# EasyEDA Pro project ESP32C3_Motor_MainControl.eprj, board ESP32C3_CAN_Host
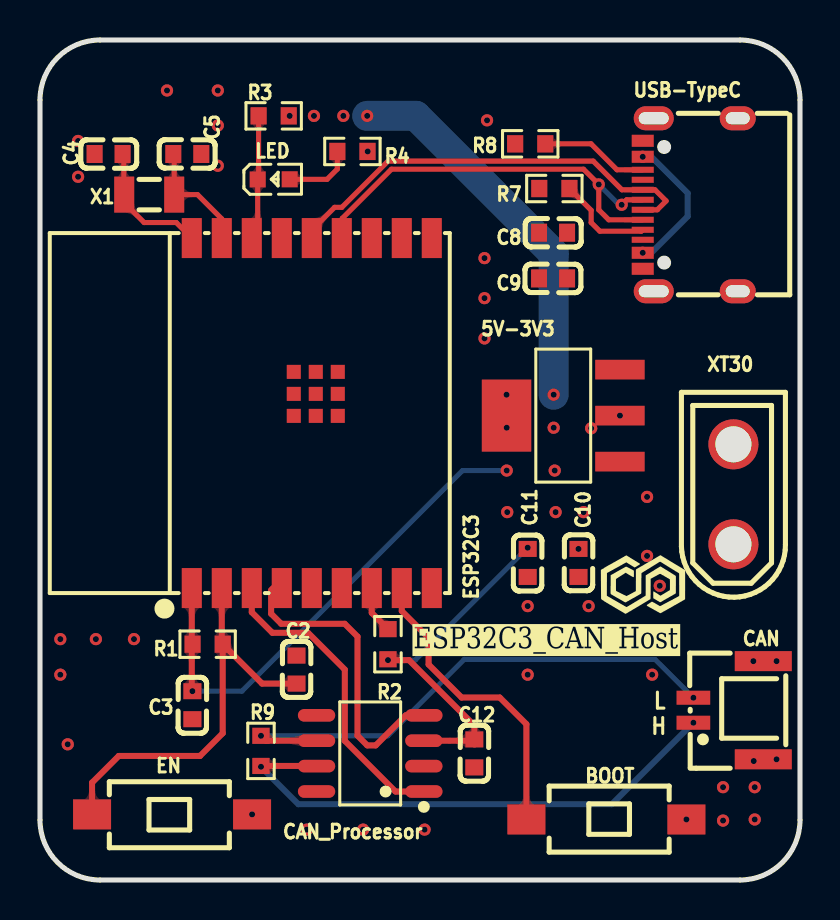
[diagram p3: board, top side]
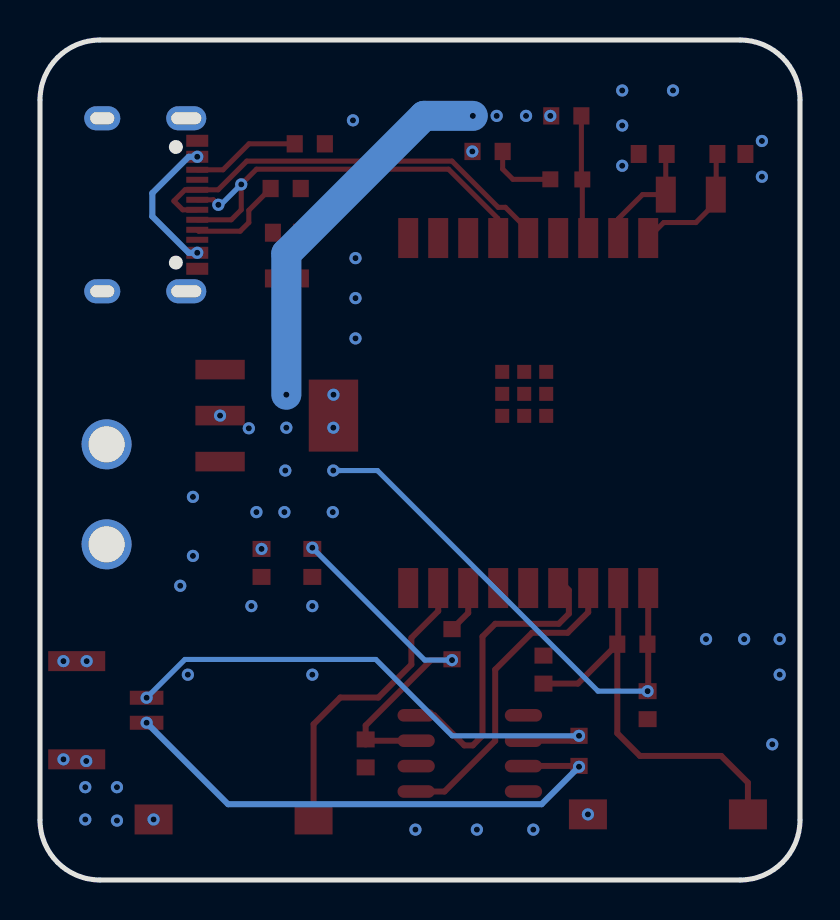
[diagram p4: board, bottom side, seen from below]

Outline 38 x 42 mm; copper layers: Top Layer, Bottom Layer. Coordinates in mm from the lower left corner of the outline.
Outline path: 0,39 0,3 arc(0.88,0.88) 3,0 35,0 arc(37.12,0.88) 38,3 38,39 arc(37.12,41.12) 35,42 3,42 arc(0.88,41.12) 0,39
Stack: Top Layer 0.035mm / Dielectric1 1.51mm FR4 er 4.5 / Bottom Layer 0.035mm

## Design rules (mm)
net CANTX: DP2
net CANRX: DP2
net USB_DN: DP1
net USB_DP: DP1
net $1N1399: DP3
net $1N1400: DP3
template: 自定义配置
spacing copperThickness1oz (default): track to track 0.102, other pairs 0.152 to 0.3
spacing copperThickness2oz: track to track 0.203, other pairs 0.152 to 0.3
track width copperThickness1oz (default): min 0.127, default 0.254, max 2.54
track width copperThickness2oz: min 0.203, default 0.254, max 2.54
differential pair differentialPair (default): width min 0.127, default 0.254, max 2.54; gap min 0.152, default 0.152
via viaSize (default): diameter min 0.5, default 0.61, max 10; hole min 0.3, default 0.305, max 6.3

## Placement (name value [footprint] x y rotation side)
5V-3V3  AMS1117-3.3  [SOT-223-4_L6.5-W3.5-P2.30-LS7.0-BR]  26.16 23.22 0 top
BOOT  TS-1101-C-W  [SW-SMD_L6.0-W3.3-LS8.0]  28.32 3.03 180 top
C2  1uF  [C0603]  12.83 10.52 270 top
C3  100nF  [C0603]  7.62 8.74 90 top
C4  12pF  [C0603]  3.43 36.3 180 top
C5  12pF  [C0603]  7.37 36.3 0 top
C8  0.1uF  [C0603]  25.65 32.36 180 top
C9  10uF  [C0603]  25.65 30.08 0 top
C10  10uF  [C0603]  26.92 15.85 270 top
C11  0.1uF  [C0603]  24.38 15.85 90 top
C12  0.1uF  [C0603]  21.72 6.33 270 top
CAN  HC-GH-2PLT  [CONN-SMD_2P-P1.25_HCTL_HC-GH-2PLT]  34.42 8.49 90 top
CAN_Processor  SIT65HVD230DR  [SOP-8_L4.9-W3.9-P1.27-LS6.0-BL]  16.51 6.33 90 top
EN  TS-1101-C-W  [SW-SMD_L6.0-W3.3-LS8.0]  6.6 3.28 0 top
ESP32C3  2.4GHz  [BULETM-SMD_ESPRESSIF_ESP32-C3-WROOM-02-N4-4MB]  13.59 23.35 90 top
LED  NCD0603R1  [LED0603-RD_RED]  11.68 35.03 0 top
R1  10kΩ  [R0603]  8.38 11.79 180 top
R2  10kΩ  [R0603]  17.4 11.79 270 top
R3  10kΩ  [R0603]  11.68 38.21 180 top
R4  1kΩ  [R0603]  15.62 36.43 0 top
R7  5.1kΩ  [R0603]  25.72 34.57 0 top
R8  5.1kΩ  [R0603]  24.51 36.81 0 top
R9  120R  [R0603]  11.05 6.46 270 top
USB-TypeC  TYPE-C 16PIN 2MD(073)  [USB-C-SMD_TYPE-C-6PIN-2MD-073]  32.51 33.76 90 top
X1  32.768kHz  [FC-135R_L3.2-W1.5]  5.46 34.27 180 top
XT30  XT30UPB-M  [CONN-TH_XT30UPB-M]  34.67 19.28 90 top

## Footprints (pads in the part's own frame, mm; a bottom-side part is the same pattern mirrored in y, then rotated)
BULETM-SMD_ESPRESSIF_ESP32-C3-WROOM-02-N4-4MB
  rect 2x1 smd: 1(-8.75,6) 2(-8.75,4.5) 3(-8.75,3) 4(-8.75,1.5) 5(-8.75,0) 6(-8.75,-1.5) 7(-8.75,-3) 8(-8.75,-4.5) 9(-8.75,-6) 10(8.75,-6) 11(8.75,-4.5) 12(8.75,-3) 13(8.75,-1.5) 14(8.75,0) 15(8.75,1.5) 16(8.75,3) 17(8.75,4.5) 18(8.75,6)
  rect 0.7x0.7 smd: 19(-0.14,0.9) 19(-0.14,-0.2) 19(-0.14,-1.3) 19(0.96,0.9) 19(0.96,-0.2) 19(0.96,-1.3) 19(2.06,0.9) 19(2.06,-0.2) 19(2.06,-1.3)
C0603
  rect 0.8x0.9 smd: 1(-0.7,0) 2(0.7,0)
CONN-SMD_2P-P1.25_HCTL_HC-GH-2PLT
  rect 0.7x1.68 smd: 1(-0.625,1.748) 2(0.625,1.748)
  rect 1x2.85 smd: 3(2.455,-1.748) 4(-2.455,-1.748)
CONN-TH_XT30UPB-M
  round 2.5 hole 1.8: 1(-2.5,0) 2(2.5,0)
FC-135R_L3.2-W1.5
  rect 1x1.8 smd: 1(-1.25,0) 2(1.25,0)
LED0603-RD_RED
  rect 0.8x0.8 smd: 1(-0.799,-0.004) 2(0.799,0.004)
R0603
  rect 0.806x0.864 smd: 1(-0.753,0) 2(0.753,0)
SOP-8_L4.9-W3.9-P1.27-LS6.0-BL
  oval 0.63x1.865 smd: 1(-1.905,-2.683) 2(-0.635,-2.683) 3(0.635,-2.683) 4(1.905,-2.683) 5(1.905,2.683) 6(0.635,2.683) 7(-0.635,2.683) 8(-1.905,2.683)
SOT-223-4_L6.5-W3.5-P2.30-LS7.0-BR
  rect 2.47x0.98 smd: 1(2.835,-2.3) 2(2.835,0) 3(2.835,2.3)
  rect 2.47x3.6 smd: 4(-2.835,0)
SW-SMD_L6.0-W3.3-LS8.0
  rect 1.9x1.5 smd: 1(-4,0) 2(4,0)
USB-C-SMD_TYPE-C-6PIN-2MD-073
  rect 0.6x1.1 smd: 1(-3.2,2.375) 2(-2.4,2.375) 11(2.4,2.375) 12(3.2,2.375)
  rect 0.3x1.1 smd: 3(-1.75,2.375) 4(-1.25,2.375) 5(-0.75,2.375) 6(-0.25,2.375) 7(0.25,2.375) 8(0.75,2.375) 9(1.25,2.375) 10(1.75,2.375)
  oval 1.2x2 hole 0.6x1.5: 13(-4.325,1.825) 14(4.325,1.825)
  oval 1.2x1.8 hole 0.6x1.2: 13(-4.325,-2.375) 14(4.325,-2.375)

## Nets
As in the schematic.

Pads without a net: CAN_Processor 5; ESP32C3 5 6 10 11 12 15; USB-TypeC 3 9

## Via types
v1: diameter 0.61, hole 0.305, Top Layer to Bottom Layer, 63 vias

## Routing (per net, layer and track width the routed paths; a pad name or vN(x,y) marks a point on that pad's centre or on a via; arc(x,y) is an arc through that point)
+5V: length 7.2
  Bottom Layer w0.3: v1(30.14,36.16) 30.57,36.16 32.38,34.34 32.38,33.18 30.57,31.36 v1(30.14,31.36)
GND:
  vias: v1(1.02,12.04) v1(1.02,10.27) v1(1.39,6.78) v1(1.91,36.95) v1(1.91,35.16) v1(2.79,12.04) v1(4.7,12.04) v1(6.35,39.48) v1(8.89,39.48) v1(8.89,37.73) v1(8.89,35.71) v1(10.6,3.28) v1(13.34,2.52) v1(16.16,2.52) v1(19.23,2.52) v1(22.22,31.09) v1(22.22,29.09) v1(22.22,27.08) v1(22.35,37.98) v1(24.38,13.69) v1(24.38,10.27) v1(27.43,13.69) v1(30.35,19.16) v1(30.35,16.2) v1(30.61,10.27) v1(30.99,14.71) v1(32.32,3.03) v1(34.15,4.64) v1(34.15,2.97) v1(35.67,10.94) v1(35.69,5.95) v1(35.74,4.64) v1(35.74,3.03) v1(36.83,10.94) v1(36.83,6.03)
VCC_3V3: length 63
  Top Layer w0.3: v1(17.4,11) 18.45,11 21.72,7.73 C12.1 ; CAN_Processor.3 21.53,6.96 21.72,6.78 ; 7.59,11.83 R1.2 ; 7.59,11.83 7.59,9.47 v1(7.62,9.44) ; 7.59,11.83 ESP32C3.1
  Bottom Layer w0.254: v1(24.38,16.62) 18.76,11 v1(17.4,11) ; v1(7.62,9.44) 10.1,9.44 21.13,20.47 v1(23.34,20.47)
  Bottom Layer w1.5: v1(25.68,24.27) 25.68,31.32 18.8,38.21 v1(16.36,38.21)
  vias: v1(12.48,38.21) v1(13.7,38.21) v1(15.17,38.21) v1(16.38,36.43) v1(23.33,24.27) v1(23.34,22.61) v1(23.36,18.39) v1(25.68,22.61) v1(25.74,20.47) v1(25.78,18.39) v1(26.92,16.55) v1(27.18,18.39) v1(27.56,22.58) v1(29,23.22)
BOOT: length 15.3
  Top Layer w0.3: BOOT.2 24.32,7.79 22.99,9.12 21.08,9.12 19.43,10.77 19.43,12.11 18.09,13.45 ESP32C3.8
CANRX: length 15.6
  Top Layer w0.3: ESP32C3.4 11.66,14.6 11.56,14.49 11.56,13.31 12.06,12.81 15.23,12.81 15.88,12.17 15.88,7.22 16.36,6.73 16.79,6.73 18.29,8.23 CAN_Processor.4
CANTX: length 15.6
  Top Layer w0.3: ESP32C3.3 10.59,13.39 11.62,12.36 13.4,12.36 15.24,10.52 15.24,6.96 17.77,4.42 CAN_Processor.1
EN: length 20.9
  Top Layer w0.3: R1.1 9.09,11.84 ESP32C3.2 ; R1.1 9.14,7.34 8,6.2 3.94,6.2 2.6,4.87 EN.1 ; R1.1 11.11,9.82 C2.2
USB_DN: length 21.6
  Top Layer w0.254: v1(29.08,33.76) 29.33,34.01 USB-TypeC.7 ; ESP32C3.13 15.11,32.12 15.11,33.08 17.57,35.54 27.18,35.54 v1(27.94,34.78) 27.94,33.51 28.44,33.01 USB-TypeC.5
  Bottom Layer w0.254: v1(27.94,34.78) 28.96,33.76 v1(29.08,33.76)
USB_DP: length 21.7
  Top Layer w0.254: USB-TypeC.6 30.87,33.51 31.31,33.95 30.75,34.51 USB-TypeC.8 29.09,34.51 27.66,35.94 17.4,35.94 15.09,33.63 14.73,33.63 13.59,32.49 ESP32C3.14
$1N818: length 6.6
  Top Layer w0.254: ESP32C3.18 6.81,32.87 5.21,32.87 4.19,33.89 4.19,36.24 C4.1
$1N819: length 5.9
  Top Layer w0.254: ESP32C3.17 9.09,33.05 7.87,34.27 X1.1 6.71,36.26 C5.1
$1N821: length 2.4
  Top Layer w0.3: ESP32C3.7 16.59,13.35 R2.1
$1N839: length 6.3
  Top Layer w0.254: R3.2 10.93,35.07 LED.1 10.88,32.39 ESP32C3.16
$1N846: length 3.5
  Top Layer w0.254: LED.2 14.35,35.03 14.87,35.55 R4.1
$1N1163: length 4.9
  Top Layer w0.254: R7.2 27.56,33.48 27.56,32.87 27.99,32.44 30.07,32.44 USB-TypeC.4
$1N1164: length 5.4
  Top Layer w0.254: USB-TypeC.10 28.85,35.51 27.55,36.81 R8.2
$1N1399: length 26.9
  Top Layer w0.3: R9.2 13.82,5.7 CAN_Processor.7
  Bottom Layer w0.3: v1(11.05,5.66) 12.92,3.79 28.6,3.79 v1(32.67,7.86)
$1N1400: length 26.9
  Top Layer w0.3: v1(11.05,7.21) 11.29,6.96 CAN_Processor.6
  Bottom Layer w0.254: v1(32.67,9.11) 30.75,11.03 21.21,11.03 17.39,7.21 v1(11.05,7.21)

## Copper pours and planes (outline as drawn; the poured copper is in the pictures)
+5V on Top Layer: 25.72,33.25 25.72,25.95 27.31,24.36 30.86,24.36 32.07,23.15 32.07,19.22 32,19.16 37.27,19.16 37.27,28.29 29.73,28.29 28.83,29.19 28.83,30.3 29.59,31.06 30.69,31.06 30.69,31.68 27.99,31.68 27.31,32.36 27.31,33.25
GND on Top Layer: -1.78,43.41 39.62,43.41 39.62,-0.28 -1.78,-0.28
GND on Bottom Layer: -5.46,46.84 46.74,46.84 46.74,-3.96 -5.46,-3.96
VCC_3V3 on Top Layer: 22.1,25 26.29,25 27.31,23.98 30.23,23.98 30.23,21.87 27.1,21.87 26.67,21.44 22.1,21.44
VCC_3V3 on Top Layer: 22.1,23.22 22.1,15.85 28.11,15.85 28.11,19.32 27.53,19.89 27.53,21.99 26.31,23.22
VCC_3V3 on Top Layer: 17.02,35.77 15.65,35.77 15.62,35.79 15.62,37.16 11.78,37.16 11.78,39 17.02,39
VCC_3V3 on Bottom Layer: 22.1,25 26.29,25 27.31,23.98 30.23,23.98 30.23,21.87 27.1,21.87 26.67,21.44 22.1,21.44
VCC_3V3 on Bottom Layer: 22.14,23.22 22.14,15.85 28.15,15.85 28.15,19.32 27.57,19.89 27.57,21.99 26.35,23.22
VCC_3V3 on Bottom Layer: 16.97,35.83 15.6,35.83 15.57,35.85 15.57,37.22 11.73,37.22 11.73,39.06 16.97,39.06

Small or netless copper shapes (teardrops, artwork), in the pictures only: 50 on Top Layer, 13 on Bottom Layer

## Text on the board
Top Silkscreen Layer: H | L | ESP32C3_CAN_Host
